# Altium schematic sheet Main.SchDoc
size A4; SheetNumber: 1; SheetTotal: 4
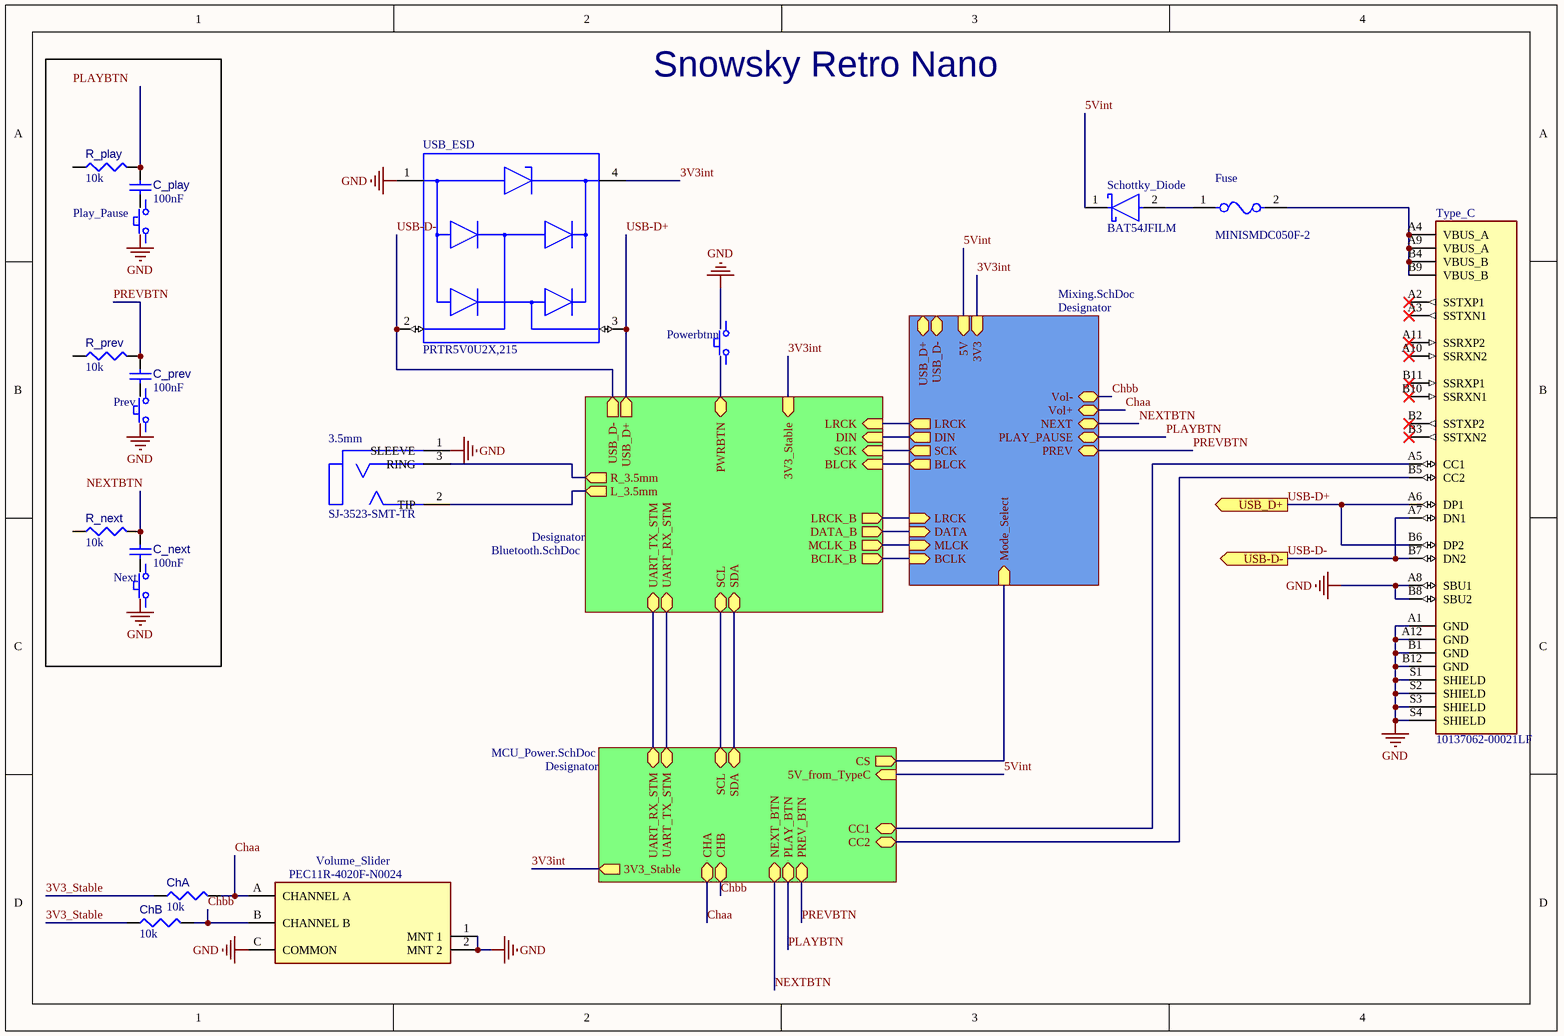
[diagram p0: Main.SchDoc]

## Parts
3.5mm  SJ-3523-SMT-TR  [CUI_SJ-3523-SMT-TR]
C_next  value 100nF  [CAPC0402(1005)60_L]  (hidden comment: Capacitor 100nF +/-20% 10V 0402)
C_play  value 100nF  [CAPC0402(1005)60_L]  (hidden comment: Capacitor 100nF +/-20% 10V 0402)
C_prev  value 100nF  [CAPC0402(1005)60_L]  (hidden comment: Capacitor 100nF +/-20% 10V 0402)
ChA  value 10k  [RESC0402(1005)_L]  (hidden comment: 10KR2F)
ChB  value 10k  [RESC0402(1005)_L]  (hidden comment: 10KR2F)
Fuse  MINISMDC050F-2  [FP-MINISMDC050F-MFG]
Next  MSP103C04  [FP-MSP103C04-MFG]  (value not drawn)
Play_Pause  MSP103C04  [FP-MSP103C04-MFG]  (value not drawn)
Powerbtnn  MSP103C04  [FP-MSP103C04-MFG]  (value not drawn)
Prev  MSP103C04  [FP-MSP103C04-MFG]  (value not drawn)
R_next  value 10k  [RESC0402(1005)_L]  (hidden comment: 10KR2F)
R_play  value 10k  [RESC0402(1005)_L]  (hidden comment: 10KR2F)
R_prev  value 10k  [RESC0402(1005)_L]  (hidden comment: 10KR2F)
Schottky_Diode  BAT54JFILM  [FP-SOD323-MFG]
Type_C  10137062-00021LF  [AMPHENOL_10137062-00021LF]
USB_ESD  PRTR5V0U2X,215  [FP-SOT143B-MFG]
Volume_Slider  PEC11R-4020F-N0024  [FP-PEC11R-4020F-N0024-MFG]

## Sub-sheets
Designator = Bluetooth.SchDoc: USB_D- (out), 3V3_Stable (in), LRCK (in), USB_D+ (out), UART_TX_STM (bidir), UART_RX_STM (bidir), DIN (in), SCK (in), BLCK (in), LRCK_B (out), DATA_B (out), MCLK_B (out), BCLK_B (out), R_3.5mm (out), SCL (bidir), SDA (bidir), PWRBTN (bidir), L_3.5mm (out)
Designator = MCU_Power.SchDoc: SCL (bidir), 5V_from_TypeC (in), CC1 (bidir), CC2 (bidir), UART_RX_STM (bidir), UART_TX_STM (bidir), SDA (bidir), 3V3_Stable (out), CS (out), CHA (bidir), CHB (bidir), PREV_BTN (bidir), NEXT_BTN (bidir), PLAY_BTN (bidir)
Designator = Mixing.SchDoc: USB_D+ (bidir), USB_D- (bidir), LRCK (out), DIN (out), SCK (out), BLCK (out), 5V (in), 3V3 (in), LRCK (in), BCLK (in), MLCK (in), DATA (in), Vol- (bidir), Vol+ (bidir), NEXT (bidir), PLAY_PAUSE (bidir), PREV (bidir), Mode_Select (in)

## Ports
USB-D- (out), USB_D+ (out)

## Nets
GND: 3.5mm.1(SLEEVE) Type_C.A1(GND) Type_C.A8(SBU1) Type_C.A12(GND) Type_C.B1(GND) Type_C.B8(SBU2) Type_C.B12(GND) Type_C.S1(SHIELD) Type_C.S2(SHIELD) Type_C.S3(SHIELD) Type_C.S4(SHIELD) USB_ESD.1(GND) Volume_Slider.1(MNT_1) Volume_Slider.2(MNT_2) Volume_Slider.C(COMMON)
3V3_Stable: ChA.1 ChB.1
3V3int: USB_ESD.4(VCC) ; sheet Designator/3V3_Stable, sheet Designator/3V3_Stable, sheet Designator/3V3
5Vint: Schottky_Diode.1(C) ; sheet Designator/5V_from_TypeC, sheet Designator/5V
Chaa: ChA.2 Volume_Slider.A(CHANNEL_A) ; sheet Designator/CHA, sheet Designator/Vol+
Chbb: ChB.2 Volume_Slider.B(CHANNEL_B) ; sheet Designator/CHB, sheet Designator/Vol-
NEXTBTN: sheet Designator/NEXT_BTN, sheet Designator/NEXT
PLAYBTN: sheet Designator/PLAY_BTN, sheet Designator/PLAY_PAUSE
PREVBTN: C_prev.2 R_prev.2 ; sheet Designator/PREV_BTN, sheet Designator/PREV
USB-D+: Type_C.A6(DP1) Type_C.B6(DP2) USB_ESD.3(I/O_2) ; port USB_D+, sheet Designator/USB_D+
USB-D-: Type_C.A7(DN1) Type_C.B7(DN2) USB_ESD.2(I/O_1) ; port USB-D-, sheet Designator/USB_D-
Net3.5mm_2: 3.5mm.2(TIP) ; sheet Designator/L_3.5mm
Net3.5mm_3: 3.5mm.3(RING) ; sheet Designator/R_3.5mm
NetC_next_2: C_next.2 R_next.2
NetC_play_2: C_play.2 R_play.2
NetFuse_1: Fuse.1 Schottky_Diode.2(A)
NetFuse_2: Fuse.2 Type_C.A4(VBUS_A) Type_C.A9(VBUS_A) Type_C.B4(VBUS_B) Type_C.B9(VBUS_B)
NetType_C_A5: Type_C.A5(CC1) ; sheet Designator/CC1
NetType_C_B5: Type_C.B5(CC2) ; sheet Designator/CC2
(unnamed): sheet Designator/LRCK, sheet Designator/LRCK
(unnamed): sheet Designator/UART_TX_STM, sheet Designator/UART_RX_STM
(unnamed): sheet Designator/UART_RX_STM, sheet Designator/UART_TX_STM
(unnamed): sheet Designator/DIN, sheet Designator/DIN
(unnamed): sheet Designator/SCK, sheet Designator/SCK
(unnamed): sheet Designator/BLCK, sheet Designator/BLCK
(unnamed): sheet Designator/LRCK_B, sheet Designator/LRCK
(unnamed): sheet Designator/DATA_B, sheet Designator/DATA
(unnamed): sheet Designator/MCLK_B, sheet Designator/MLCK
(unnamed): sheet Designator/BCLK_B, sheet Designator/BCLK
(unnamed): sheet Designator/SCL, sheet Designator/SCL
(unnamed): sheet Designator/SDA, sheet Designator/SDA
(unnamed): sheet Designator/CS, sheet Designator/Mode_Select

Not connected (* = marked no-connect by the designer): C_next 1; C_play 1; C_prev 1; R_next 1; R_play 1; R_prev 1; Type_C A2(SSTXP1)* A3(SSTXN1)* A10(SSRXN2)* A11(SSRXP2)* B2(SSTXP2)* B3(SSTXN2)* B10(SSRXN1)* B11(SSRXP1)*

## Notes on the sheet
- Snowsky Retro Nano
- Labels drawn without touching a wire or pin: GND, NEXTBTN, PLAYBTN

## Library data of the parts
3.5mm = CMP-002-00072-1: 3.5 mm, Stereo, Right Angle, Surface Mount (SMT), 3 Conductors, 0 Internal Switches, Audio Jack Connector; MF: Same Sky; Component Type: Standard; Design Item ID: SJ-3523-SMT-TR; SnapEDA_Link: https://www.snapeda.com/parts/SJ-3523-SMT-TR/Same+Sky/view-part/?ref=snap; Check_prices: https://www.snapeda.com/parts/SJ-3523-SMT-TR/Same+Sky/view-part/?ref=eda; Source: SJ-3523-SMT-TR.SchLib; Value: *; Pins: 3; MP: SJ-3523-SMT-TR; Case/Package: None
C_next C_play C_prev = CMP-001-00061-3: Chip Capacitor, 100nF +/-20%, 10V, 0402, Thickness 0.6 mm; Tolerance: 20%; Mounting Technology: SMT; Voltage Rating: 10V; Max Operating Temperature: 85°C; Pins: 2; Case/Package: 0402; Min Operating Temperature: -55°C
ChA ChB R_next R_play R_prev = CMP-009-00066-2: 10K 0.063W 1% 0402 (1005 Metric)  SMD; Power: 63mW; Case/Package: 0402; Mounting Technology: SMT; Pins: 2; Tolerance: 1%
Fuse = CMP-08606-000031-1: PTC RESET FUSE 24V 500MA 1812; Manufacturer: Littelfuse; Hold Current: 0.5A; Current Rating: 100A; Trip Current: 1A; Resistance: 0.15-1Ω; Value: 0.15-1Ω; Trip Time: 0.15s; Voltage Rating: 24V; RoHS: TRUE; Category: Fuse; Height: 0.62mm; Device Class L1: Circuit Protection; Lead Free: Yes; Digikey Description: PTC RESET FUSE 24V 500MA 1812; Device Class L3: unset; ComponentLink2URL: https://www.littelfuse.com/~/media/electronics/product_specifications/resettable_ptcs/littelfuse_ptc_minismdc050f_2_product_specification.pdf.pdf; Octopart: https://octopart.com/minismdc050f-2-littelfuse-74215011; Device Class L2: PTC Resettable Fuses; Footprint Url: https://www.littelfuse.com/~/media/electronics/datasheets/resettable_ptcs/littelfuse_ptc_minismd_catalog_datasheet.pdf.pdf; Package: MINISMDC050F; Mouser Description: PTC Resettable Fuse 0.5A(hold) 1A(trip) 24VDC 100A 0.8W 0.15s 0.15Ohm SMD Solder Pad 4.5 x 3.2 mm T/R; Ambient Temperature Range Low: -40°C; Ambient Temperature Range High: +85°C; Automotive: No; Manufacturer Part Number: MINISMDC050F-2; ComponentLink2Description: Datasheet
Next Play_Pause Powerbtnn Prev = CMP-03402-000012-1: SWITCH PUSH SPST-NO 3A 125V; Actuator Material: Thermoplastic; Electrical Life: 5000Cycles; Actuator Color: Red; Contact Resistance: 20mR; Number of Poles: 1; Switch Function: Off-Mom; Max Voltage Rating (DC): 5V; Illumination Type: Illuminated; Throw Configuration: SPST; Actuator Length: 2.5mm; Max Operating Temperature: 80°C; Voltage Rating (AC): 125V; Packaging: Bulk; Min Operating Temperature: -20°C; Contact Current Rating: 3A; Mount: Panel; Max Current Rating: 3A; Max Voltage Rating (AC): 125V; Series: MSP3; Depth: 11.99mm; Radiation Hardening: No; Package Quantity: 25; Type: Switch; Orientation: Straight; Contact Plating: Silver; Termination: Lug; Housing Material: Polymer; Current Rating: 3A; RoHS Compliant: Yes; Number of Positions: 1; Contact Material: Copper Alloy; Illumination Color: Red; Length: 11.99mm
Schottky_Diode = CMP-2000-05927-2: DIODE SCHOTTKY 40V 300MA SOD323; Manufacturer: STMicroelectronics; Max Surge Forward Current: 1.25A; Value: 7pF; Max Junction Temp: +150°C; Peak Reverse Current: 1uA; Standoff Height: 0mm; ComponentLink2Description: Datasheet; Device Class L2: Diodes; Mouser Description: Schottky Diodes & Rectifiers 300mA 40 Volt; Forward Current: 300mA; Temperature Range Low: -40°C; Temperature Range High: +150°C; Digikey Description: DIODE SCHOTTKY 40V 300MA SOD323; Capacitance: 7pF; Ipc Land Pattern Name: SOD250128X117-2; Automotive: No; Manufacturer Part Number: BAT54JFILM; Device Class L1: Discrete Semiconductors; Lead Free: Yes; ComponentLink2URL: https://www.st.com/resource/en/datasheet/bat54.pdf; Package: SOD323; Temperature: -40°C to +150°C; Category: IC; Height: 1.17mm; Octopart: https://octopart.com/bat54jfilm-stmicroelectronics-326073; RoHS: TRUE; Device Class L3: Schottky Diodes; Max Repetitive Reverse Voltage: 40V
Type_C = CMP-002-00071-1: USB-C (USB TYPE-C) USB 3.2 Gen 2 (USB 3.1 Gen 2, Superspeed + (USB 3.1)) Receptacle Connector 24 Position Surface Mount, Right Angle; Through Hole; MF: Amphenol; MP: 1013706200021LF; Value: *; Case/Package: None; Check_prices: https://www.snapeda.com/parts/1013706200021LF/Amphenol/view-part/?ref=eda; Source: 10137062-00021LF.SchLib; Component Type: Standard; SnapEDA_Link: https://www.snapeda.com/parts/1013706200021LF/Amphenol/view-part/?ref=snap; Pins: 28; Design Item ID: 10137062-00021LF
USB_ESD = CMP-14436-000007-1: TVS DIODE 5.5V SOT143B
Volume_Slider = CMP-07421-000043-1: ROTARY ENCODER MECHANICAL 24PPR; Number of Channels: 2; Hole Diameter: 1.8mm; Output Type: Quadrature; Pulses per Revolution: 24; Built in Switch: No; Termination: PC Pin; Packaging: Bulk; Max Operating Temperature: 70°C; Encoder Type: Mechanical; Width: 12.5mm; Height: 13.4mm; Package Quantity: 75; Min Operating Temperature: -30°C; Radiation Hardening: No; Mount: Through Hole; Series: PEC11R; Number of Pins: 3; Orientation: Vertical; RoHS Compliant: Yes; Length: 26.5mm; Detent: No